# EAGLE design espMDL_dht11_1B (EAGLE 7.5.0)
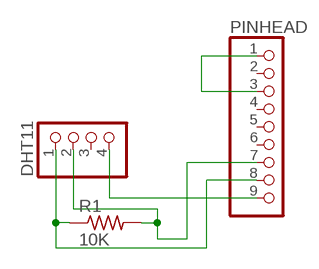
[diagram p0: schematic, sheet 1]

## Parts
DHT11  PINHD-1X4  [1X04]
PINHEAD  PINHD-1X9  [1X09]
R1  10K  R-US_0204/7  [0204/7]

## Nets
N$1: DHT11.4 PINHEAD.9
N$2: DHT11.1 PINHEAD.8 R1.1
N$3: PINHEAD.1 PINHEAD.3
N$4: DHT11.2 PINHEAD.7 R1.2
Unconnected: DHT11.3 PINHEAD.2 PINHEAD.4 PINHEAD.5 PINHEAD.6

## Library data of the parts
DHT11 = pinhead:PINHD-1X4: PIN HEADER
PINHEAD = pinhead:PINHD-1X9: PIN HEADER
R1 = resistor:R-US_: RESISTOR, American symbol

## Board
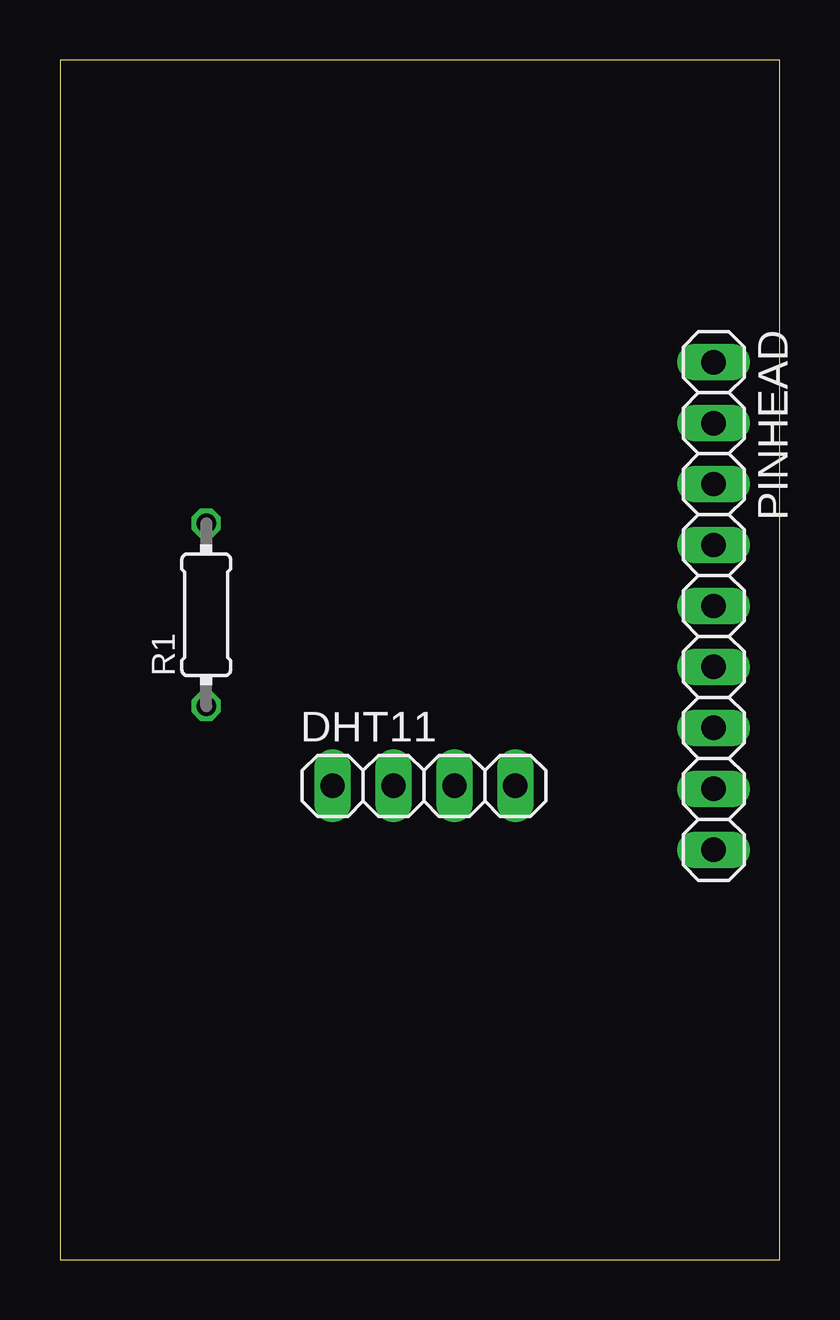
[diagram p1: board, top side]
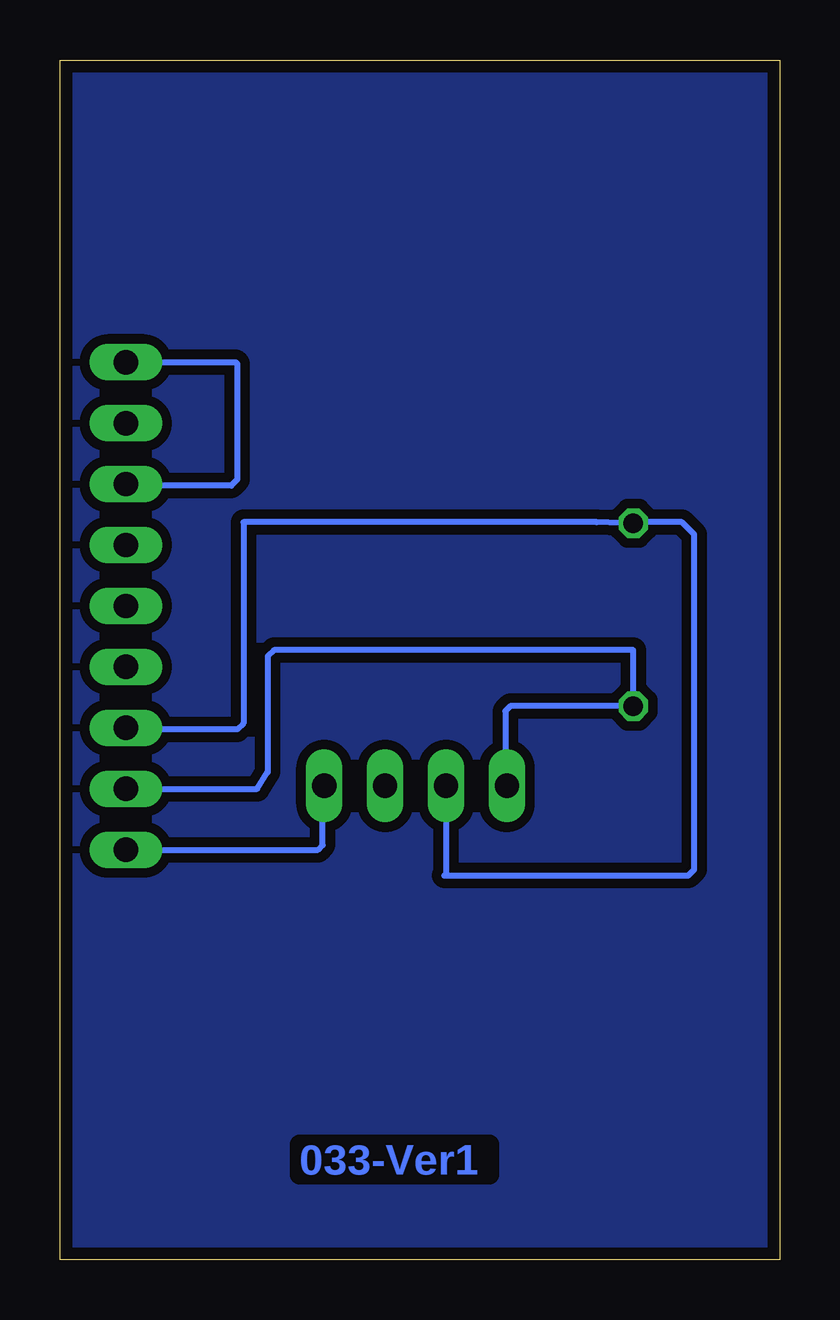
[diagram p2: board, bottom side, seen from below]

Size 30 x 50 mm. Coordinates in mm from the lower left corner, seen from the top.
Outline: 0,0 30,0 30,50 0,50 0,0
Copper layers (1*16): Top 0.035mm / dielectric 1.6mm / Bottom 0.035mm
Design rules "Elecrow_2-layer_PCB_eagle_rule": minimum track width 6mil, minimum drill 12mil, track to track 6mil, track to pad 6mil, pad to pad 6mil, via to via 8mil, smd to smd 0mil, copper to edge 20mil, drill to drill 10mil, minimum pad ring 6mil, minimum via ring 6mil, stop-mask expansion 0mil, vias tented up to drill 100mil, thermal gap 10mil

### Footprints (pad centres in the part's own frame; a part is rotated, then mirrored left to right if it is on the bottom)
1X04 = drill 1.016 long: 1 -3.81,0; 2 -1.27,0; 3 1.27,0; 4 3.81,0
1X09 = drill 1.016 long: 1 -10.16,0; 2 -7.62,0; 3 -5.08,0; 4 -2.54,0; 5 0,0; 6 2.54,0; 7 5.08,0; 8 7.62,0; 9 10.16,0
0204/7 = drill 0.813 octagon: 1 -3.81,0; 2 3.81,0

### Placement (x,y rotation side)
DHT11  15.18,19.75 0 top
PINHEAD  27.26,27.24 270 top
R1  6.1,26.88 90 top

### Tracks (layer width: path | path; a pad name or v marks a point on that pad's centre or on a via)
N$1
  Bottom 0.254: PINHEAD.9 19.24,17.08 19.05,17.27 19.05,19.68 DHT11.4
N$2
  Bottom 0.254: PINHEAD.8 21.78,19.62 21.34,20.32 21.34,25.15 21.08,25.4 6.1,25.4 R1.1 11.22,23.07 11.43,22.86 11.43,19.81 DHT11.1
N$3
  Bottom 0.254: PINHEAD.1 22.67,37.4 22.61,37.34 22.61,32.51 22.86,32.26 27.19,32.26 PINHEAD.3
N$4
  Bottom 0.254: PINHEAD.7 27.19,22.1 22.61,22.1 22.35,22.35 22.35,30.73 7.62,30.73 R1.2 6.05,30.73 4.06,30.73 3.56,30.23 3.56,16.26 3.81,16 13.97,16 13.91,16.07 DHT11.2
N$5
  pour Bottom (isolate 0.406, no thermals): 0,50 0,0 30,0 30,50

### Text on the board
Bottom: 033-Ver1